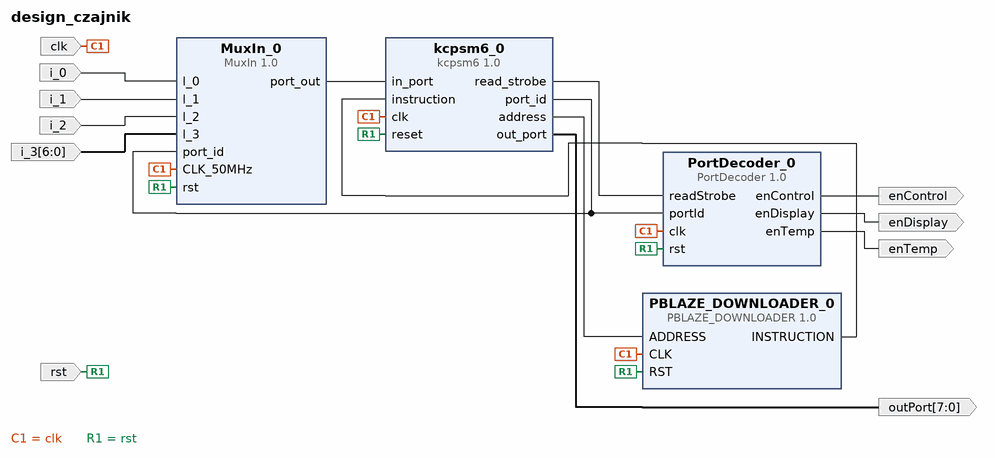
[diagram p0: block diagram of the top level]
# Vivado block design design_czajnik, xc7z020clg400-3, Vivado 2017.4
create_bd_design design_czajnik

create_bd_port -dir I clk
create_bd_port -dir I rst
create_bd_port -dir O -from 7 -to 0 outPort
create_bd_port -dir O enTemp
create_bd_port -dir O enControl
create_bd_port -dir O enDisplay
create_bd_port -dir I i_0
create_bd_port -dir I i_1
create_bd_port -dir I i_2
create_bd_port -dir I -from 6 -to 0 i_3

create_bd_cell -type ip -vlnv xilinx.com:user:PBLAZE_DOWNLOADER:1.0 PBLAZE_DOWNLOADER_0
create_bd_cell -type ip -vlnv xilinx.com:user:kcpsm6:1.0 kcpsm6_0
create_bd_cell -type ip -vlnv xilinx.com:user:MuxIn:1.0 MuxIn_0
create_bd_cell -type ip -vlnv xilinx.com:user:PortDecoder:1.0 PortDecoder_0

# ---- connections ----

connect_bd_net [get_bd_pins kcpsm6_0/address] [get_bd_pins PBLAZE_DOWNLOADER_0/ADDRESS]
connect_bd_net [get_bd_pins PBLAZE_DOWNLOADER_0/INSTRUCTION] [get_bd_pins kcpsm6_0/instruction]
connect_bd_net [get_bd_pins MuxIn_0/port_out] [get_bd_pins kcpsm6_0/in_port]
connect_bd_net [get_bd_ports clk] \
  [get_bd_pins MuxIn_0/CLK_50MHz] [get_bd_pins PBLAZE_DOWNLOADER_0/CLK] [get_bd_pins kcpsm6_0/clk] \
  [get_bd_pins PortDecoder_0/clk]
connect_bd_net [get_bd_ports rst] \
  [get_bd_pins MuxIn_0/rst] [get_bd_pins PBLAZE_DOWNLOADER_0/RST] [get_bd_pins PortDecoder_0/rst] \
  [get_bd_pins kcpsm6_0/reset]
connect_bd_net [get_bd_pins kcpsm6_0/read_strobe] [get_bd_pins PortDecoder_0/readStrobe]
connect_bd_net [get_bd_pins kcpsm6_0/port_id] [get_bd_pins PortDecoder_0/portId] [get_bd_pins MuxIn_0/port_id]
connect_bd_net [get_bd_pins kcpsm6_0/out_port] [get_bd_ports outPort]
connect_bd_net [get_bd_pins PortDecoder_0/enTemp] [get_bd_ports enTemp]
connect_bd_net [get_bd_pins PortDecoder_0/enControl] [get_bd_ports enControl]
connect_bd_net [get_bd_pins PortDecoder_0/enDisplay] [get_bd_ports enDisplay]
connect_bd_net -net i_0_1 [get_bd_ports i_0] [get_bd_pins MuxIn_0/l_0]
connect_bd_net -net i_1_1 [get_bd_ports i_1] [get_bd_pins MuxIn_0/l_1]
connect_bd_net -net i_2_1 [get_bd_ports i_2] [get_bd_pins MuxIn_0/l_2]
connect_bd_net -net i_3_1 [get_bd_ports i_3] [get_bd_pins MuxIn_0/l_3]

validate_bd_design
save_bd_design
